# Altium schematic sheet LPEDT_revA1_bikeit_SENSOR_MECH.SchDoc: BME280 Sensor Mechanical
size A; Author: Dhruva Koley; DocumentNumber: 1; Revision: 1; SheetNumber: 1; SheetTotal: 12
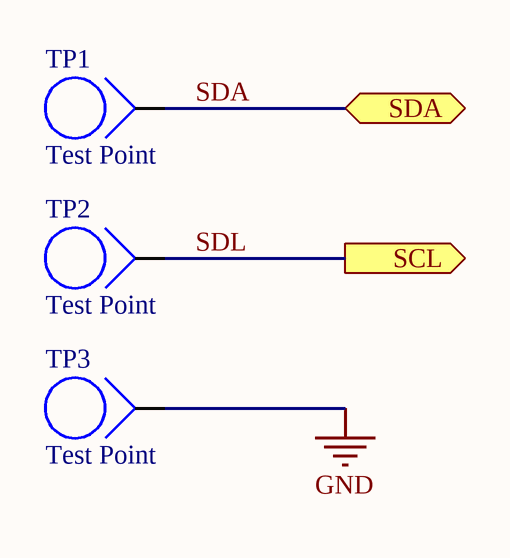
[diagram p0: LPEDT_revA1_bikeit_SENSOR_MECH.SchDoc]

## Parts
TP1  Test Point
TP2  Test Point
TP3  Test Point

## Ports
SCL (out), SDA (bidir)

## Nets
GND: TP3.1
SDA: TP1.1 ; port SDA
SDL: TP2.1 ; port SCL

## Library data of the parts
TP1-TP3 = Test Pad